# EAGLE design Schematic7 (EAGLE 7.7.0)
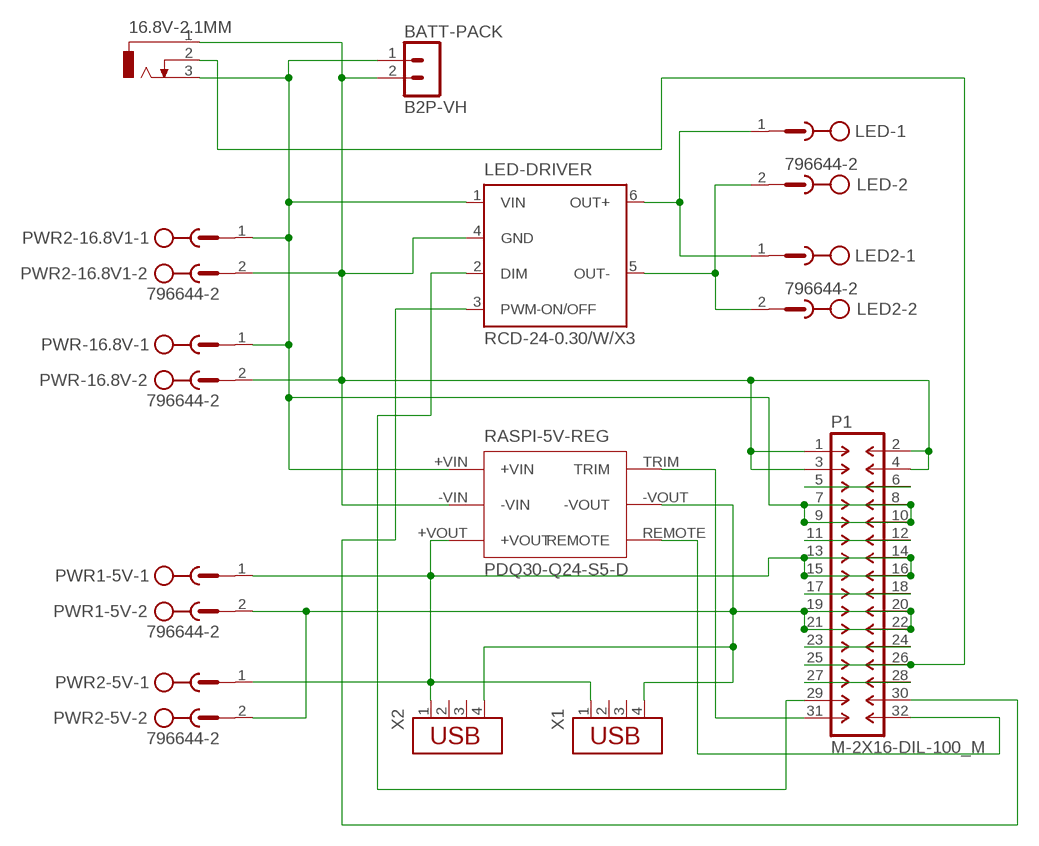
[diagram p0: schematic, sheet 1]

## Parts
16.8V-2.1MM  DCJ0303  [DCJ0303]
BATT-PACK  B2P-VH  [B2P-VH]
LED  796644-2  [796644-2]
LED2  796644-2  [796644-2]
LED-DRIVER  RCD-24-0.30/W/X3  [RCD-24/W/X3]
P1  M-2X16-DIL-100_M  [DIL-100-2X16_M]
PWR1-5V  796644-2  [796644-2]
PWR2-5V  796644-2  [796644-2]
PWR2-16.8V1  796644-2  [796644-2]
PWR-16.8V  796644-2  [796644-2]
RASPI-5V-REG  PDQ30-Q24-S5-D  [PDQ30-Q24-S5-D]
X1  USB-787616  [USB]
X2  USB-787616  [USB]

## Nets
5VOUT+: P1.13 P1.14 P1.15 P1.16 PWR1-5V.1 PWR2-5V.1 RASPI-5V-REG.+VOUT X1.1 X2.1
5VOUT-: P1.19 P1.20 P1.21 P1.22 PWR1-5V.2 PWR2-5V.2 RASPI-5V-REG.-VOUT X1.4 X2.4
BAT+: 16.8V-2.1MM.3 BATT-PACK.1 LED-DRIVER.1(VIN) P1.7 P1.8 P1.9 P1.10 PWR2-16.8V1.1 PWR-16.8V.1 RASPI-5V-REG.+VIN
BAT-: 16.8V-2.1MM.1 BATT-PACK.2 LED-DRIVER.4(GND) P1.1 P1.2 P1.3 P1.4 PWR2-16.8V1.2 PWR-16.8V.2 RASPI-5V-REG.-VIN
DIM: LED-DRIVER.2(DIM) P1.29
LED+: LED2.1 LED-DRIVER.6(OUT+) LED.1
LED-: LED2.2 LED-DRIVER.5(OUT-) LED.2
N$1: P1.23 P1.24
N$2: P1.5 P1.6
N$3: 16.8V-2.1MM.2 P1.25 P1.26
N$4: P1.27 P1.28
N$13: P1.11 P1.12
N$16: P1.17 P1.18
PWM: LED-DRIVER.3(PWM-ON/OFF) P1.30
REMOTE: P1.32 RASPI-5V-REG.REMOTE
TRIM: P1.31 RASPI-5V-REG.TRIM
Unconnected: X1.2 X1.3 X2.2 X2.3

## Library data of the parts
16.8V-2.1MM = con-jack:DCJ0303: DC POWER JACK Source: DCJ0303.pdf; OC_FARNELL: unknown; OC_NEWARK: unknown
BATT-PACK = con-jst-vh:B2P-VH: HEADER
LED LED2 PWR1-5V PWR2-5V PWR2-16.8V1 PWR-16.8V = con-amp-termi-block:796644-2: TERMI-BLOCK, 5MM
LED-DRIVER = recom-international:RCD-24*/W/X3: Constant Current Output LED Driver Analogue Dimming and PWM Dimming ON/OFF Source: http://www.recom-international.de/pdf/Innoline/RCD-24.pdf; OC_FARNELL: unknown; OC_NEWARK: unknown
P1 = con-headers-jp:M-2X16-: MALE HEADER
RASPI-5V-REG = PDQ30-Q24-S5-D:PDQ30-Q24-S5-D
X1 X2 = con-amp:USB-787616: AMP connector

## Board
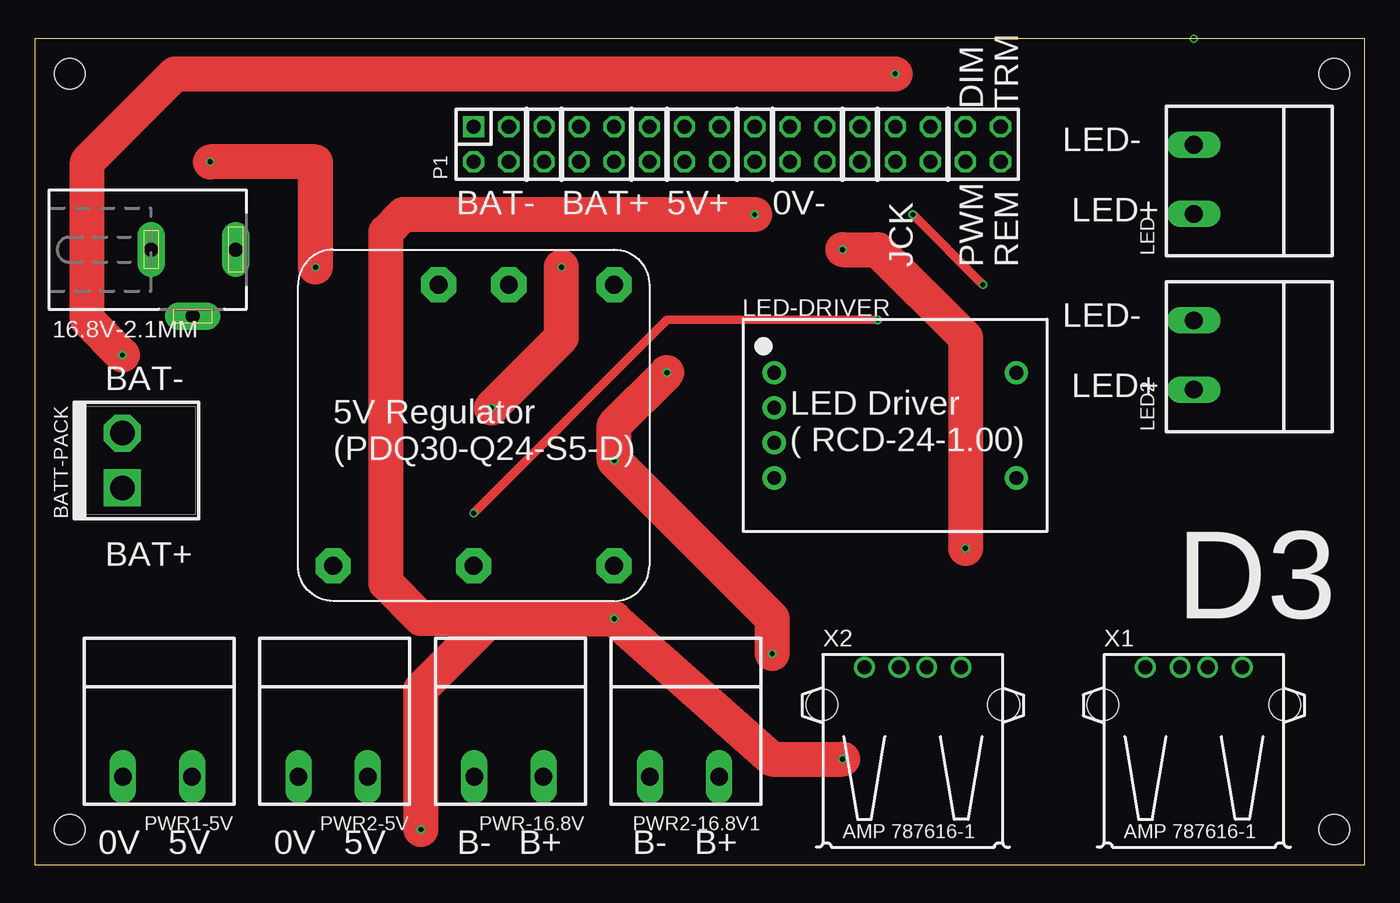
[diagram p1: board, top side]
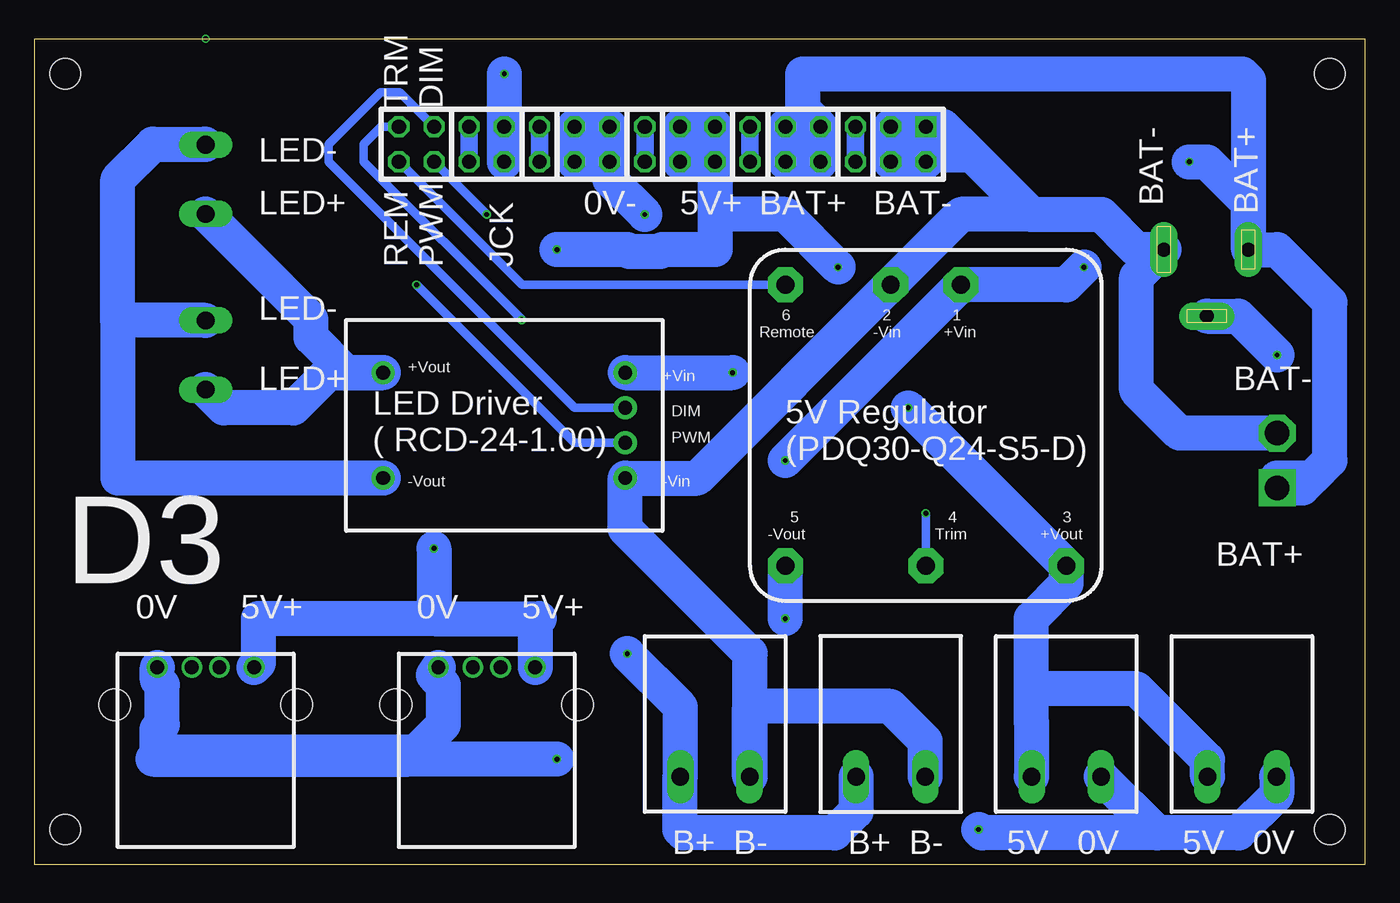
[diagram p2: board, bottom side, seen from below]

Size 96.19 x 59.68 mm. Coordinates in mm from the lower left corner, seen from the top.
Outline: 0,0 96.19,0 96.19,59.68 0,59.68 0,0
Copper layers (1*16): Top 0.035559375mm / dielectric 1.6mm / Bottom 0.035559375mm
Design rules "oshpark-2layer": minimum track width 6mil, minimum drill 10mil, track to track 6mil, track to pad 6mil, pad to pad 6mil, via to via 6mil, smd to smd 6mil, copper to edge 15mil, drill to drill 6mil, minimum pad ring 5mil, minimum via ring 5mil, stop-mask expansion 2.5mil, vias tented up to drill 0mil, thermal gap 10mil
Holes 2.2 mm at 2.54,2.54 2.54,57.15 93.98,57.15 93.98,2.54

### Footprints (pad centres in the part's own frame; a part is rotated, then mirrored left to right if it is on the bottom)
DCJ0303 = drill 1 pad 2 long: 1 0,3.1; 2 4.8,0; 3 0,-3
B2P-VH = drill 1.778 square: 1 -1.98,0 | drill 1.778 octagon: 2 1.98,0
796644-2 = drill 1.27 pad 1.93 long: 1 -2.5,0; 2 2.5,0
RCD-24/W/X3 = drill 1 pad 1.676: 1 -8.75,3.81; 2 -8.75,1.27; 3 -8.75,-1.27; 4 -8.75,-3.81; 5 8.75,-3.81; 6 8.75,3.81
DIL-100-2X16_M = drill 1.016 square: 1 -19.05,1.27 | drill 1.016 octagon: 2 -19.05,-1.27; 3 -16.51,1.27; 4 -16.51,-1.27; 5 -13.97,1.27; 6 -13.97,-1.27; 7 -11.43,1.27; 8 -11.43,-1.27; 9 -8.89,1.27; 10 -8.89,-1.27; 11 -6.35,1.27; 12 -6.35,-1.27; 13 -3.81,1.27; 14 -3.81,-1.27; 15 -1.27,1.27; 16 -1.27,-1.27; 17 1.27,1.27; 18 1.27,-1.27; 19 3.81,1.27; 20 3.81,-1.27; 21 6.35,1.27; 22 6.35,-1.27; 23 8.89,1.27; 24 8.89,-1.27; 25 11.43,1.27; 26 11.43,-1.27; 27 13.97,1.27; 28 13.97,-1.27; 29 16.51,1.27; 30 16.51,-1.27; 31 19.05,1.27; 32 19.05,-1.27
PDQ30-Q24-S5-D = drill 1.3 pad 2.54 octagon: +VIN -2.54,10.16; +VOUT -10.16,-10.16; -VIN 2.54,10.16; -VOUT 10.16,-10.16; REMOTE 10.16,10.16; TRIM 0,-10.16
USB = drill 1: 1 -3.5,12.99; 2 -1,12.99; 3 1,12.99; 4 3.5,12.99 | hole 2.3: -6.57,10.28; 6.57,10.28

### Placement (x,y rotation side)
16.8V-2.1MM  11.43,44.45 270 top
BATT-PACK  6.35,29.21 90 top
LED  83.82,49.53 90 top
LED2  83.82,36.83 90 top
LED-DRIVER  62.23,31.75 0 top
P1  50.8,52.07 0 top
PWR1-5V  8.89,6.35 180 top
PWR2-5V  21.59,6.35 180 top
PWR2-16.8V1  46.99,6.35 180 top
PWR-16.8V  34.29,6.35 180 top
RASPI-5V-REG  31.75,31.75 0 top
X1  83.82,1.27 0 top
X2  63.5,1.27 0 top

### Tracks (layer width: path | path; a pad name or v marks a point on that pad's centre or on a via)
5VOUT+  (via drill 0.35)
  Top 2.54: v58.42,44.45 60.96,44.45 67.31,38.1 v67.31,22.86 | v33.02,33.02 38.1,38.1 v38.1,43.18
  Bottom 2.54: 24.13,12.7 24.13,17.78 21.59,20.32 RASPI-5V-REG.+VOUT v33.02,33.02 | 24.13,10.31 24.13,12.7 | 24.13,10.31 24.13,6.35 | 24.13,12.7 16.51,12.7 11.39,7.58 PWR1-5V.1 | X2.1 60,17.47 59.69,17.78 67.31,17.78 | 67.31,17.78 80.01,17.78 80.01,14.57 X1.1 | P1.14 46.99,46.99 | P1.14 P1.13 P1.15 P1.16 P1.14 | 46.99,46.99 46.99,44.45 50.8,44.45 50.95,44.3 53.18,44.3 53.34,44.45 v58.42,44.45 | v67.31,22.86 67.31,17.78 | v38.1,43.18 41.91,46.99 46.99,46.99 | PWR2-5V.1 24.09,10.27 24.13,10.31
5VOUT-  (via drill 0.35)
  Top 2.54: v58.42,7.62 53.34,7.62 v41.91,17.78 33.02,17.78 | v27.94,2.54 27.94,12.7 33.02,17.78 | 33.02,17.78 27.94,17.78 25.4,20.32 25.4,45.72 26.67,46.99 v52.07,46.99
  Bottom 2.54: 67,13.34 67.38,13.71 X2.4 67,13.34 | X1.4 87.32,13.34 86.95,12.97 86.95,10.13 87.33,9.75 87.33,8.13 87.31,8.11 68.65,8.11 | v41.91,17.78 RASPI-5V-REG.-VOUT | v58.42,7.62 69.14,7.62 | 68.65,8.11 66.63,10.13 66.63,12.97 67,13.34 | 69.14,7.62 68.65,8.11 | 87.63,7.62 69.14,7.62 | PWR1-5V.2 6.39,5.04 9.14,2.29 15.03,2.29 | 15.03,2.29 PWR2-5V.2 | 15.03,2.29 27.69,2.29 v27.94,2.54 | 54.61,49.53 v52.07,46.99 | 54.61,49.53 P1.20 P1.22 P1.21 P1.19 54.61,49.53
BAT+  (via drill 0.35)
  Top 2.54: v12.7,50.8 20.32,50.8 v20.32,43.18 | v45.72,35.56 41.91,31.75 v41.91,29.21 53.34,17.78 v53.34,15.24
  Bottom 2.54: 16.8V-2.1MM.3 6.35,44.45 2.54,40.64 2.54,29.21 | 2.54,29.21 3.81,27.94 6.35,27.94 | 16.8V-2.1MM.3 8.43,47.8 11.43,50.8 v12.7,50.8 | v20.32,43.18 21.59,41.91 RASPI-5V-REG.+VIN v41.91,29.21 | 49.53,11.43 49.49,11.39 | 49.53,11.43 v53.34,15.24 | 49.49,11.39 PWR2-16.8V1.1 49.53,6.31 49.53,2.54 49.28,2.29 38.35,2.29 36.79,3.85 PWR-16.8V.1 | 49.49,11.39 49.53,11.43 | LED-DRIVER.1 v45.72,35.56 | P1.7 P1.9 P1.10 P1.8 P1.7 | P1.7 40.64,54.61 40.64,57.15 8.89,57.15 8.43,56.69 16.8V-2.1MM.3 | BATT-PACK.1 4.52,27.23 2.54,29.21
BAT-
  Bottom 2.54: BATT-PACK.2 13.41,31.19 16.51,34.29 16.51,42.47 16.8V-2.1MM.1 16.51,44.45 19.05,46.99 24.13,46.99 | 24.13,46.99 29.21,46.99 RASPI-5V-REG.-VIN 48.26,27.94 LED-DRIVER.4 53.48,24.27 44.45,15.24 44.45,11.43 | 44.45,11.43 44.45,6.35 | PWR-16.8V.2 31.79,8.93 34.29,11.43 44.45,11.43 | P1.1 30.48,53.34 28.43,51.29 | 28.43,51.29 24.13,46.99 | P1.2 P1.4 P1.3 P1.1 | P1.2 P1.1 | P1.2 31.26,51.29 28.43,51.29 | PWR2-16.8V1.2 44.49,11.39 44.45,11.43
DIM
  Bottom 0.61: P1.29 69.79,55.82 71.18,55.82 74.93,52.07 74.93,50.8 57.15,33.02 LED-DRIVER.2
LED+
  Bottom 2.54: LED2.1 82.51,33.02 77.47,33.02 74.93,35.56 LED-DRIVER.6 73.66,35.56 76.2,38.1 76.2,39.41 LED.1
LED-
  Bottom 2.54: LED-DRIVER.5 90.17,27.94 90.17,39.17 | 90.17,39.17 90.17,49.53 87.63,52.07 83.86,52.07 LED.2 | LED2.2 90.01,39.33 90.17,39.17
N$1
  Bottom 1.27: P1.23 P1.24
N$2
  Bottom 1.27: P1.6 P1.5
N$3  (via drill 0.35)
  Top 2.54: v6.35,36.83 3.81,39.37 3.81,50.8 10.16,57.15 v62.23,57.15
  Bottom 2.54: 16.8V-2.1MM.2 9.17,39.65 v6.35,36.83 | v62.23,57.15 P1.25 P1.26
N$4
  Bottom 1.27: P1.28 P1.27
N$5  (via drill 0.35)
  other vias: 83.82,59.69
N$13
  Bottom 1.27: P1.12 P1.11
N$16
  Bottom 1.27: P1.17 P1.18
PWM  (via drill 0.35)
  Top 0.61: v68.58,41.91 v63.5,46.99
  Bottom 0.61: LED-DRIVER.3 57.15,30.48 v68.58,41.91 | v63.5,46.99 P1.30
REMOTE
  Bottom 0.61: RASPI-5V-REG.REMOTE 60.96,41.91 P1.32
TRIM  (via drill 0.35)
  Top 0.61: v60.96,39.37 45.72,39.37 v31.75,25.4
  Bottom 0.61: P1.31 71.12,53.34 72.39,52.07 72.39,50.8 v60.96,39.37 | v31.75,25.4 RASPI-5V-REG.TRIM

### Text on the board
tPlace: DIM | TRM | LED- | LED+ | BAT- | BAT+ | 5V+ | 0V- | JCK | PWM | REM | LED- | LED+ | BAT- | 5V Regulator / (PDQ30-Q24-S5-D) | LED Driver / ( RCD-24-1.00) | BAT+ | D3 | 0V | 5V | 0V | 5V | B- | B+ | B- | B+
bPlace: DIM | TRM | BAT+ | LED- | BAT- | BAT- | BAT+ | 5V+ | 0V- | LED+ | JCK | PWM | REM | LED- | 1 / +Vin | 2 / -Vin | 6 / Remote | +Vout | BAT- | +Vin | LED+ | DIM | PWM | 5V Regulator / (PDQ30-Q24-S5-D) | LED Driver / ( RCD-24-1.00) | -Vin | -Vout | 3 / +Vout | 4 / Trim | 5 / -Vout | BAT+ | D3 | 5V+ | 0V | 5V+ | 0V | 0V | 5V | 0V | 5V | B- | B+ | B- | B+